# EAGLE design pcb_top (EAGLE 9.6.2)
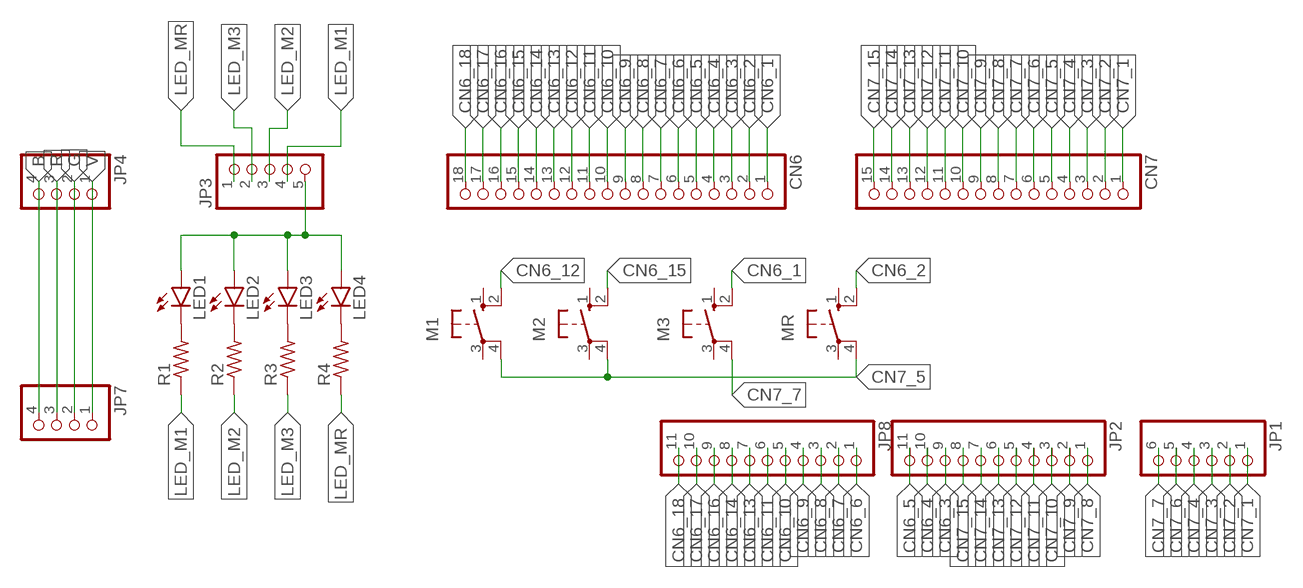
[diagram p0: schematic, sheet 1]

## Parts
CN6  THROUHOLE18  [THROUHOLE18]
CN7  THROUHOLE15  [THROUHOLE15]
JP1  THROUHOLE06  [THROUHOLE06]
JP2  THROUHOLE11  [THROUHOLE11]
JP3  THROUHOLE05  [THROUHOLE05]
JP4  THROUHOLE04  [THROUHOLE04]
JP7  THROUHOLE04  [THROUHOLE04]
JP8  THROUHOLE11  [THROUHOLE11]
LED1  LEDCHIPLED_1206  [CHIPLED_1206]
LED2  LEDCHIPLED_1206  [CHIPLED_1206]
LED3  LEDCHIPLED_1206  [CHIPLED_1206]
LED4  LEDCHIPLED_1206  [CHIPLED_1206]
M1  10-XX  [B3F-10XX]
M2  10-XX  [B3F-10XX]
M3  10-XX  [B3F-10XX]
MR  10-XX  [B3F-10XX]
R1  R-US_R0603  [R0603]
R2  R-US_R0603  [R0603]
R3  R-US_R0603  [R0603]
R4  R-US_R0603  [R0603]

## Nets
B: JP4.4 JP7.4
CN6_1: CN6.1 M3.2(S1)
CN6_2: CN6.2 MR.2(S1)
CN6_3: CN6.3 JP2.9
CN6_4: CN6.4 JP2.10
CN6_5: CN6.5 JP2.11
CN6_6: CN6.6 JP8.1
CN6_7: CN6.7 JP8.2
CN6_8: CN6.8 JP8.3
CN6_9: CN6.9 JP8.4
CN6_10: CN6.10 JP8.5
CN6_11: CN6.11 JP8.6
CN6_12: CN6.12 M1.2(S1)
CN6_13: CN6.13 JP8.7
CN6_14: CN6.14 JP8.8
CN6_15: CN6.15 M2.2(S1)
CN6_16: CN6.16 JP8.9
CN6_17: CN6.17 JP8.10
CN6_18: CN6.18 JP8.11
CN7_1: CN7.1 JP1.1
CN7_2: CN7.2 JP1.2
CN7_3: CN7.3 JP1.3
CN7_4: CN7.4 JP1.4
CN7_5: CN7.5 M1.4(P1) M2.4(P1) MR.4(P1)
CN7_6: CN7.6 JP1.5
CN7_7: CN7.7 JP1.6 M3.4(P1)
CN7_8: CN7.8 JP2.1
CN7_9: CN7.9 JP2.2
CN7_10: CN7.10 JP2.3
CN7_11: CN7.11 JP2.4
CN7_12: CN7.12 JP2.5
CN7_13: CN7.13 JP2.6
CN7_14: CN7.14 JP2.7
CN7_15: CN7.15 JP2.8
G: JP4.2 JP7.2
LED_M1: JP3.4 R1.1
LED_M2: JP3.3 R2.1
LED_M3: JP3.2 R3.1
LED_MR: JP3.1 R4.1
N$5: JP3.5 LED1.A LED2.A LED3.A LED4.A
N$6: LED1.C R1.2
N$7: LED2.C R2.2
N$8: LED3.C R3.2
N$9: LED4.C R4.2
R: JP4.3 JP7.3
V: JP4.1 JP7.1
Unconnected: M1.1(S) M1.3(P) M2.1(S) M2.3(P) M3.1(S) M3.3(P) MR.1(S) MR.3(P)

## Library data of the parts
CN6 = pinhead-half-pitch:THROUHOLE18
CN7 = pinhead-half-pitch:THROUHOLE15
JP1 = pinhead-half-pitch:THROUHOLE06
JP2 JP8 = pinhead-half-pitch:THROUHOLE11
JP3 = pinhead-half-pitch:THROUHOLE05
JP4 JP7 = pinhead-half-pitch:THROUHOLE04
LED1-LED4 = led:LED: LED OSRAM: - CHIPLED LG R971, LG N971, LY N971, LG Q971, LY Q971, LO R971, LY R971 LH N974, LH R974 LS Q976, LO Q976, LY Q976 LO Q996 - Hyper CHIPLED LW Q18S LB Q993, LB Q99A, LB R99A - SideLED LS A670, LO A670, LY A670, LG A670, LP A670 LB A673, LV A673, LT A673, LW A673 LH A674 LY A675 LS A676, LA A676, LO A676, LY A676, LW A676 LS A679, LY A679, LG A679 - Hyper Micro SIDELED® LS Y876, LA Y876, LO Y876, LY Y876 LT Y87S - SmartLED LW L88C, LW L88S LB L89C, LB L89S, LG L890 LS L89K, LO L89K, LY L89K LS L896, LA L896, LO L896, LY L896 - TOPLED LS T670, LO T670, LY T670, LG T670, LP T670 LSG T670, LSP T670, LSY T670, LOP T670, LYG T670 LG T671, LOG T671, LSG T671 LB T673, LV T673, LT T673, LW T673 LH T674 LS T676, LA T676, LO T676, LY T676, LB T676, LH T676, LSB T676, LW T676 LB T67C, LV T67C, LT T67C, LS T67K, LO T67K, LY T67K, LW E67C LS E67B, LA E67B, LO E67B, LY E67B, LB E67C, LV E67C, LT E67C LW T67C LS T679, LY T679, LG T679 LS T770, LO T770, LY T770, LG T770, LP T770 LB T773, LV T773, LT T773, LW T773 LH T774 LS E675, LA E675, LY E675, LS T675 LS T776, LA T776, LO T776, LY T776, LB T776 LHGB T686 LT T68C, LB T68C - Hyper Mini TOPLED® LB M676 - Mini TOPLED Santana® LG M470 LS M47K, LO M47K, LY M47K Source: http://www.osram.convergy.de LUXEON: - LUMILED® LXK2-PW12-R00, LXK2-PW12-S00, LXK2-PW14-U00, LXK2-PW14-V00 LXK2-PM12-R00, LXK2-PM12-S00, LXK2-PM14-U00 LXK2-PE12-Q00, LXK2-PE12-R00, LXK2-PE12-S00, LXK2-PE14-T00, LXK2-PE14-U00 LXK2-PB12-K00, LXK2-PB12-L00, LXK2-PB12-M00, LXK2-PB14-N00, LXK2-PB14-P00, LXK2-PB14-Q00 LXK2-PR12-L00, LXK2-PR12-M00, LXK2-PR14-Q00, LXK2-PR14-R00 LXK2-PD12-Q00, LXK2-PD12-R00, LXK2-PD12-S00 LXK2-PH12-R00, LXK2-PH12-S00 LXK2-PL12-P00, LXK2-PL12-Q00, LXK2-PL12-R00 Source: www.luxeon.com KINGBRIGHT: KA-3528ASYC Source: www.kingbright.com
M1-M3 MR = switch-omron:10-XX: OMRON SWITCH; MPN: B3F-1000; OC_FARNELL: 176432; OC_NEWARK: 36M3542
R1-R4 = rcl:R-US_: RESISTOR, American symbol; SPICEPREFIX: R

## Board
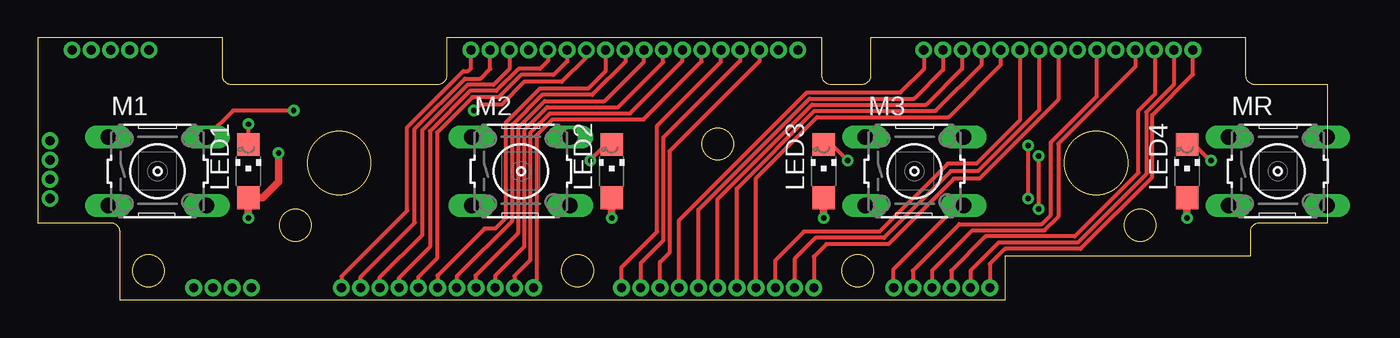
[diagram p1: board, top side]
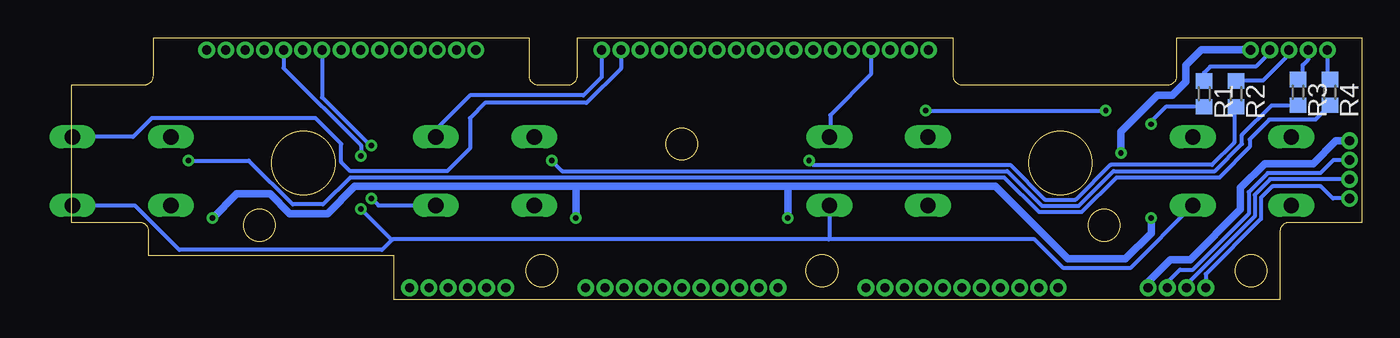
[diagram p2: board, bottom side, seen from below]

Size 85.2 x 17.3 mm. Coordinates in mm from the lower left corner, seen from the top.
Outline: 85.2,14.2 80.4,14.2 arc-90 79.8,14.8 79.8,17.3 55,17.3 55,14.8 arc-90 54.4,14.2 52.4,14.2 arc-90 51.8,14.8 51.8,17.3 27,17.3 27,14.8 arc-90 26.4,14.2 12.8,14.2 arc-90 12.2,14.8 12.2,17.3 0,17.3 0,5.1 4.8,5.1 arc-90 5.4,4.5 5.4,0 63.9,0 63.9,2.9 80.1,2.9 80.1,4.5 arc-90 80.7,5.1 85.2,5.1 85.2,14.2
Outline: circle at 69.9,9.05 radius 2.1
Outline: circle at 19.9,9.05 radius 2.1
Outline: circle at 44.9,10.3 radius 1.05
Outline: circle at 17.01,4.93 radius 1.05
Outline: circle at 7.3,1.92 radius 1.05
Outline: circle at 35.65,1.92 radius 1.05
Outline: circle at 54.15,1.92 radius 1.05
Outline: circle at 72.79,4.93 radius 1.05
Copper layers (1*16): Top 0.035mm / dielectric 1.5mm / Bottom 0.035mm
Design rules "PCBGoGo": minimum track width 6mil, minimum drill 0.2mm, track to track 6mil, track to pad 6mil, pad to pad 6mil, via to via 6mil, smd to smd 6mil, copper to edge 0.2mm, drill to drill 6mil, minimum pad ring 10mil, minimum via ring 8mil, stop-mask expansion 4mil, vias tented up to drill 0mil, thermal gap 10mil

### Footprints (pad centres in the part's own frame; a part is rotated, then mirrored left to right if it is on the bottom)
THROUHOLE18 = drill 0.6: 1 -10.795,0; 2 -9.525,0; 3 -8.255,0; 4 -6.985,0; 5 -5.715,0; 6 -4.445,0; 7 -3.175,0; 8 -1.905,0; 9 -0.635,0; 10 0.635,0; 11 1.905,0; 12 3.175,0; 13 4.445,0; 14 5.715,0; 15 6.985,0; 16 8.255,0; 17 9.525,0; 18 10.795,0
THROUHOLE15 = drill 0.6: 1 -8.89,0; 2 -7.62,0; 3 -6.35,0; 4 -5.08,0; 5 -3.81,0; 6 -2.54,0; 7 -1.27,0; 8 0,0; 9 1.27,0; 10 2.54,0; 11 3.81,0; 12 5.08,0; 13 6.35,0; 14 7.62,0; 15 8.89,0
THROUHOLE06 = drill 0.6: 1 -3.175,0; 2 -1.905,0; 3 -0.635,0; 4 0.635,0; 5 1.905,0; 6 3.175,0
THROUHOLE11 = drill 0.6: 1 -6.35,0; 2 -5.08,0; 3 -3.81,0; 4 -2.54,0; 5 -1.27,0; 6 0,0; 7 1.27,0; 8 2.54,0; 9 3.81,0; 10 5.08,0; 11 6.35,0
THROUHOLE05 = drill 0.6: 1 -2.54,0; 2 -1.27,0; 3 0,0; 4 1.27,0; 5 2.54,0
THROUHOLE04 = drill 0.6: 1 -1.905,0; 2 -0.635,0; 3 0.635,0; 4 1.905,0
CHIPLED_1206 = smd 1.5 x 1.5: A 0,-1.75; C 0,1.75
B3F-10XX = drill 1.016 long: 1 -3.251,2.261; 2 3.251,2.261; 3 -3.251,-2.261; 4 3.251,-2.261
R0603 = smd 1 x 1.1: 1 -0.85,0; 2 0.85,0

### Placement (x,y rotation side)
CN6  39.4,16.5 180 top
CN7  67.4,16.5 180 top
JP1  59.7,0.8 180 top
JP2  44.9,0.8 180 top
JP3  4.8,16.5 0 top
JP4  0.8,8.6 270 top
JP7  12.2,0.8 180 top
JP8  26.4,0.8 180 top
LED1  13.9,8.5 0 top
LED2  37.9,8.5 0 top
LED3  51.9,8.5 0 top
LED4  75.9,8.5 0 top
M1  7.9,8.5 0 top
M2  31.9,8.5 0 top
M3  57.9,8.5 0 top
MR  81.9,8.5 0 top
R1  10.4,13.6 270 bottom
R2  8.3,13.6 270 bottom
R3  4.2,13.7 270 bottom
R4  2.1,13.7 270 bottom

### Tracks (layer width: path | path; a pad name or v marks a point on that pad's centre or on a via)
B
  Bottom 0.254: JP4.4 1.89,6.69 2.7,7.5 5.9,7.5 6.65,6.75 6.65,5.35 10.3,1.71 JP7.4
CN6_1
  Bottom 0.254: CN6.1 50.2,14.7 51.4,13.5 58.9,13.5 61.15,11.25 M3.2
CN6_2
  Bottom 0.254: CN6.2 48.92,15.27 51.2,13 57.9,13 58.9,12 58.9,10 60.4,8.5 66.8,8.5 67.4,9.1 67.4,10.3 69.1,12 79.91,12 81.15,10.76 MR.2
CN6_3
  Top 0.254: CN6.3 47.66,15.75 41.71,9.81 41.71,3.11 41.09,2.49 JP2.9
CN6_4
  Top 0.254: CN6.4 46.38,15.78 41.31,10.71 41.31,3.91 39.82,2.42 JP2.10
CN6_5
  Top 0.254: CN6.5 45.12,15.71 40.9,11.5 40.9,4.5 38.55,2.15 JP2.11
CN6_6
  Top 0.254: CN6.6 43.84,15.74 40.01,11.91 33.98,11.91 32.93,10.86 32.93,0.98 JP8.1
CN6_7
  Top 0.254: CN6.7 42.57,15.77 39.12,12.32 33.82,12.32 32.53,11.03 32.53,2.63 31.48,1.58 JP8.2
CN6_8
  Top 0.254: CN6.8 41.3,15.7 38.32,12.72 33.65,12.72 32.12,11.19 32.12,3.52 30.2,1.6 JP8.3
CN6_9
  Top 0.254: CN6.9 40.03,15.73 37.43,13.13 33.48,13.13 31.71,11.36 31.71,4.41 28.9,1.6 28.9,0.84 JP8.4
CN6_10
  Top 0.254: CN6.10 38.8,16.46 38.8,15.72 36.61,13.54 33.31,13.54 31.31,11.53 31.31,5.21 27.67,1.57 JP8.5
CN6_11
  Top 0.254: CN6.11 37.49,15.09 36.34,13.94 33.14,13.94 30.9,11.7 30.9,5.4 30.2,4.7 29.5,4.7 26.4,1.6 JP8.6
CN6_12  (via drill 0.35)
  Top 0.254: v16.9,12.5 12.89,12.5 M1.2 | CN6.12 36.22,16.02 34.6,14.4 32.12,14.4 30.62,12.9 29.2,12.9 v28.8,12.5
  Bottom 0.254: v28.8,12.5 v16.9,12.5
CN6_13
  Top 0.254: JP8.7 25.13,1.51 26.36,2.74 26.36,11.04 28.71,13.39 30.44,13.39 31.9,14.85 34.05,14.85 34.95,15.75 CN6.13
CN6_14
  Top 0.254: JP8.8 23.86,1.46 25.9,3.5 25.9,11.15 28.54,13.79 30.27,13.79 31.73,15.25 33.16,15.25 33.69,15.78 CN6.14
CN6_15
  Bottom 0.254: CN6.15 32.41,14.88 35.1,12.2 35.1,10.81 M2.2
CN6_16
  Top 0.254: JP8.9 22.59,1.49 25.4,4.3 25.4,11.22 28.38,14.2 30.1,14.2 31.14,15.24 CN6.16
CN6_17
  Top 0.254: JP8.10 21.32,1.52 24.9,5.1 24.9,11.3 28.21,14.61 29.23,14.61 29.88,15.25 CN6.17
CN6_18
  Top 0.254: CN6.18 28.6,15.3 28.4,15.1 28.1,15.1 24.4,11.4 24.4,5.9 20.05,1.55 JP8.11
CN7_1
  Top 0.254: CN7.1 76.29,14.89 73.61,12.21 73.61,8.11 68.87,3.37 63.87,3.37 62.88,2.37 JP1.1
CN7_2
  Top 0.254: CN7.2 75.02,14.22 73.2,12.4 73.2,8.3 68.68,3.78 63.45,3.78 61.6,1.93 JP1.2
CN7_3
  Top 0.254: CN7.3 73.8,16.45 73.8,13.6 72.7,12.5 72.7,8.4 68.49,4.19 62.59,4.19 60.34,1.93 JP1.3
CN7_4
  Top 0.254: CN7.4 72.48,15.38 67.4,10.3 67.4,5.5 66.49,4.59 61.72,4.59 59.06,1.93 JP1.4
CN7_5  (via drill 0.35)
  Top 0.254: v66.1,9.5 v66.1,6
  Bottom 0.254: M1.4 15.29,2.1 19.7,2.1 21.6,4 35.2,4 | M2.4 35.15,4.05 35.2,4 | 35.2,4 64,4 | v66.1,9.5 66.1,10.2 71.21,15.31 CN7.5 | MR.4 81.04,6.24 78.1,3.3 64.7,3.3 64,4 | v66.1,6 64.1,4 64,4
CN7_6
  Top 0.254: 69.94,16.24 CN7.6 69.94,13.44 66.9,10.4 66.9,5.6 66.3,5 60.86,5 57.8,1.93 JP1.5
CN7_7  (via drill 0.35)
  Top 0.254: v65.4,10.2 v65.4,6.7 | JP1.6 56.52,2.02 60.74,6.24 M3.4
  Bottom 0.254: CN7.7 68.67,13.37 65.5,10.2 v65.4,10.2 | v65.4,6.7 64.94,6.24 M3.4
CN7_8
  Top 0.254: CN7.8 67.4,13.2 62.2,8 60.5,8 56.19,3.69 52.09,3.69 51.25,2.85 JP2.1
CN7_9
  Top 0.254: CN7.9 66.13,12.53 62.1,8.5 60.3,8.5 55.89,4.09 51.37,4.09 49.98,2.7 JP2.2
CN7_10
  Top 0.254: CN7.10 64.86,11.86 62,9 60.1,9 55.6,4.5 50.6,4.5 48.71,2.61 JP2.3
CN7_11
  Top 0.254: CN7.11 63.59,15.5 60.16,12.07 51.47,12.07 47.44,8.04 JP2.4
CN7_12
  Top 0.254: CN7.12 62.32,15.5 59.3,12.48 51.3,12.48 46.17,7.35 JP2.5
CN7_13
  Top 0.254: CN7.13 61.05,15.25 58.69,12.89 51.14,12.89 44.9,6.65 JP2.6
CN7_14
  Top 0.254: CN7.14 59.78,15.18 57.89,13.29 50.97,13.29 43.63,5.95 JP2.7
CN7_15
  Top 0.254: CN7.15 58.51,15.23 56.98,13.7 50.8,13.7 42.36,5.26 JP2.8
G
  Bottom 0.254: JP4.2 1.87,9.23 2.73,8.37 6.2,8.37 7.47,7.11 7.47,5.68 11.15,2 12,2 12.7,1.3 12.7,0.93 JP7.2
LED_M1
  Bottom 0.254: JP3.4 6.07,16.33 7,15.4 10,15.4 10.4,15 R1.1
LED_M2
  Bottom 0.254: JP3.3 4.8,16.2 6.5,14.5 8.25,14.5 R2.1
LED_M3
  Bottom 0.254: JP3.2 3.53,15.87 3.9,15.5 3.9,14.85 R3.1
LED_MR
  Bottom 0.254: JP3.1 2.26,14.71 R4.1
N$5  (via drill 0.35)
  Top 0.508: LED4.A v75.9,5.4 | v15.9,9.7 15.9,7.8 14.85,6.75 LED1.A v13.9,5.4 | LED3.A v51.9,5.4 | LED2.A v37.9,5.4
  Bottom 0.508: 37.9,7.5 24.2,7.5 19.4,2.7 15.6,2.7 13.9,4.4 v13.9,5.4 | v15.9,9.7 15.9,11.1 13.5,13.5 12.5,13.5 11.6,14.4 11.6,15.5 10.6,16.5 JP3.5 | v37.9,5.4 37.9,7.5 | 37.9,7.5 51.9,7.5 | 51.9,7.5 66.5,7.5 68.3,5.7 70.8,5.7 72.1,7 74.3,7 v75.9,5.4 | v51.9,5.4 51.9,7.5
N$6  (via drill 0.35)
  Top 0.254: v13.9,11.6 LED1.C
  Bottom 0.254: R1.2 12.95,12.75 13.9,11.8 v13.9,11.6
N$7  (via drill 0.35)
  Top 0.254: LED2.C 37.5,10.25 36.5,9.25 v36.5,9.2
  Bottom 0.254: R2.2 8.41,12.64 8.41,10.39 9.89,8.92 16.59,8.92 18.89,6.61 20.91,6.61 23.21,8.92 36.22,8.92 v36.5,9.2
N$8  (via drill 0.35)
  Top 0.254: LED3.C 52.45,10.25 v53.5,9.2
  Bottom 0.254: R3.2 5.95,12.85 7.91,10.89 7.91,10.29 9.69,8.5 16.39,8.5 18.69,6.21 21.11,6.21 23.41,8.5 52.8,8.5 v53.5,9.2 | v53.5,9.2
N$9  (via drill 0.35)
  Top 0.254: v77.5,9.2 77.45,9.2 76.4,10.25 LED4.C
  Bottom 0.254: R4.2 3.05,11.9 6.1,11.9 7.4,10.6 7.4,10.1 9.4,8.08 16.2,8.08 18.5,5.8 21.3,5.8 23.6,8.08 66.8,8.08 68.6,6.3 70.6,6.3 73.5,9.2 v77.5,9.2
R
  Bottom 0.254: JP4.3 6.03,7.96 7.06,6.94 7.06,5.52 11.56,1.01 JP7.3
V
  Bottom 0.508: JP4.1 1.7,10.5 3.2,9 6.4,9 8,7.4 8,5.98 11.32,2.66 12.63,2.66 14.09,1.2 JP7.1